# Altium schematic sheet MPU_6050_Sheet1.SchDoc
size A4; SheetNumber: 4; SheetTotal: 11
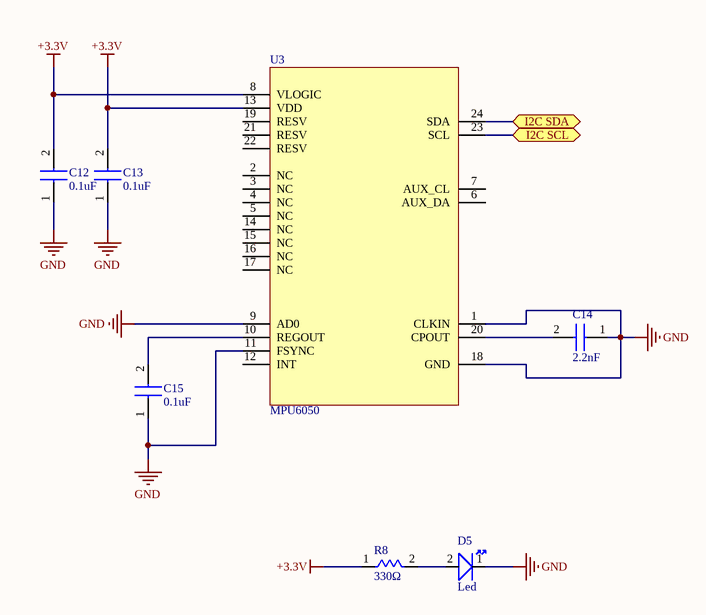
[diagram p0: MPU_6050_Sheet1.SchDoc]

## Parts
C12  0.1uF  [CAP - 0603]
C13  0.1uF  [CAP - 0603]
C14  2.2nF  [CAP - 0603]
C15  0.1uF  [CAP - 0603]
D5  Led  [LED - 0603]
R8  330Ω  [RES - 0603]
U3  MPU6050  [QFN50P400X400X90_HS-25N - duplicate]

## Ports
I2C SCL (bidir), I2C SDA (bidir)

## Nets
+3.3V: C12.2 C13.2 R8.1 U3.8(VLOGIC) U3.13(VDD)
GND: C12.1 C13.1 C14.1 C15.1 D5.1 U3.1(CLKIN) U3.9(AD0) U3.11(FSYNC) U3.18(GND)
I2C SCL: U3.23(SCL) ; port I2C SCL
I2C SDA: U3.24(SDA) ; port I2C SDA
NetC14_2: C14.2 U3.20(CPOUT)
NetC15_2: C15.2 U3.10(REGOUT)
NetD5_2: D5.2 R8.2

Not connected (* = marked no-connect by the designer): U3 2(NC) 3(NC) 4(NC) 5(NC) 6(AUX_DA) 7(AUX_CL) 12(INT) 14(NC) 15(NC) 16(NC) 17(NC) 19(RESV) 21(RESV) 22(RESV)

## Library data of the parts
C12-C15 = CAP: Capacitor; ComponentLink1Description: Satın Alma Linki; ComponentLink1URL: https://ozdisan.com/pasif-komponentler/kondansatorler/smt-smd-ve-mlcc-kondansatorler/CL10B472KB8NNNC; ComponentLink2Description: Satın Alma Linki; ComponentLink2URL: https://ozdisan.com/pasif-komponentler/kondansatorler/smt-smd-ve-mlcc-kondansatorler/CL10C200JB8NNNC; ComponentLink3Description: Satın Alma Linki; ComponentLink3URL: https://ozdisan.com/pasif-komponentler/kondansatorler/smt-smd-ve-mlcc-kondansatorler/CL10B104KB8NNNC; ComponentLink4Description: Datasheet; ComponentLink4URL: https://cdn.ozdisan.com/ETicaret_Dosya/448212_5798276.PDF; ComponentLink5Description: Satın Alma Linki; ComponentLink5URL: https://ozdisan.com/pasif-komponentler/kondansatorler/smt-smd-ve-mlcc-kondansatorler/CL10C101JB8NNNC
D5 = Led: HL-PST-1608U51GC - LED SMD 0603 GREEN 500mcd 120° WATER CLEAR; ComponentLink1Description: Satın Alma Linki; ComponentLink1URL: https://ozdisan.com/Product/Detail/471660/HL-PST-1608U51GC; ComponentLink2Description: Datasheet; ComponentLink2URL: https://cdn.ozdisan.com/ETicaret_Dosya/471660_7204356.pdf
R8 = Res: SMD Res; ComponentLink1Description: Datasheet; ComponentLink1URL: https://cdn.ozdisan.com/ETicaret_Dosya/570122_9878629.pdf; ComponentLink2Description: Satın Alma Linki; ComponentLink2URL: https://www.ozdisan.com/pasif-komponentler/direncler/smt-smd-direncler/TC0325B3301T5C; ComponentLink3Description: Satın Alma Linki; ComponentLink3URL: https://ozdisan.com/pasif-komponentler/direncler/smt-smd-ve-cip-direncler/0603SAF4701T5E; ComponentLink4Description: Satın Alma Linki; ComponentLink4URL: https://ozdisan.com/pasif-komponentler/direncler/smt-smd-ve-cip-direncler/0805S8F604JT5E; ComponentLink5Description: Satın Alma Linki; ComponentLink5URL: https://ozdisan.com/pasif-komponentler/direncler/smt-smd-ve-cip-direncler/0603SAF1022T5E; ComponentLink6Description: Satın Alma Linki; ComponentLink6URL: https://www.ozdisan.com/pasif-komponentler/direncler/smt-smd-direncler/CQ03SAF0000T5E
U3 = MPU6050: MPU6050 GYRO; ComponentLink1Description: Satın Alma Linki; ComponentLink1URL: https://tr.aliexpress.com/item/1005001724323744.html?gatewayAdapt=glo2tur&_randl_currency=TRY&_randl_shipto=TR&src=google&aff_fcid=dbdd7f5563804875a046a33b7e55afff-1643366594388-08611-UneMJZVf&aff_fsk=UneMJZVf&aff_platform=aaf&sk=UneMJZVf&aff_trace_key=dbdd7f5563804875a046a33b7e55afff-1643366594388-08611-UneMJZVf&terminal_id=cd33f9e12bf84a9c9c6bb26df30b5329; ComponentLink2Description: Datasheet; ComponentLink2URL: https://invensense.tdk.com/wp-content/uploads/2015/02/MPU-6000-Datasheet1.pdf